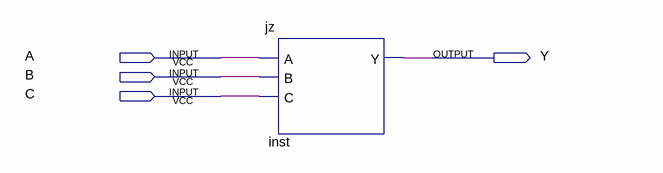
[diagram p0: schematic sheet]
// Quartus schematic JZVHDL.bdf as structural Verilog: 1 symbols, 4 pins
module JZVHDL (
  input  A,
  input  B,
  input  C,
  output Y
);

  jz inst (.A(A), .B(B), .C(C), .Y(Y));
endmodule
